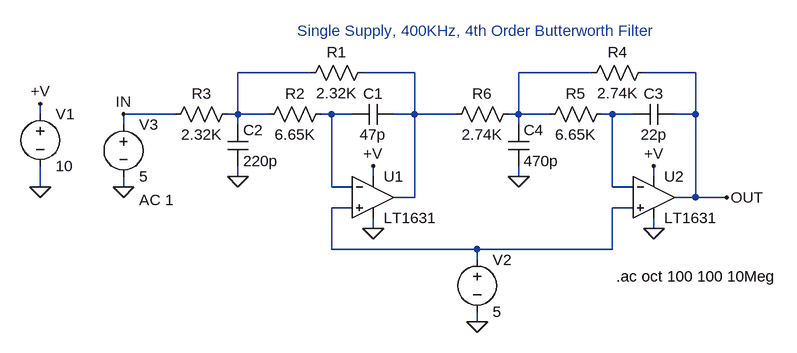
[diagram p0: schematic 1631.asc]
1631.asc, the LTspice schematic file:
Version 4
SHEET 1 1020 680
WIRE 256 96 144 96
WIRE 416 96 336 96
WIRE 688 96 576 96
WIRE 848 96 768 96
WIRE -160 160 -160 144
WIRE 48 160 -32 160
WIRE 144 160 144 96
WIRE 144 160 128 160
WIRE 192 160 144 160
WIRE 288 160 272 160
WIRE 320 160 288 160
WIRE 416 160 416 96
WIRE 416 160 384 160
WIRE 480 160 416 160
WIRE 576 160 576 96
WIRE 576 160 560 160
WIRE 624 160 576 160
WIRE 720 160 704 160
WIRE 752 160 720 160
WIRE 848 160 848 96
WIRE 848 160 816 160
WIRE -32 176 -32 160
WIRE 144 176 144 160
WIRE 576 176 576 160
WIRE 144 256 144 240
WIRE 352 256 352 240
WIRE 576 256 576 240
WIRE 784 256 784 240
WIRE -160 272 -160 240
WIRE -32 272 -32 256
WIRE 288 272 288 160
WIRE 320 272 288 272
WIRE 720 272 720 160
WIRE 752 272 720 272
WIRE 416 288 416 160
WIRE 416 288 384 288
WIRE 848 288 848 160
WIRE 848 288 816 288
WIRE 896 288 848 288
WIRE 320 304 288 304
WIRE 752 304 720 304
WIRE 352 336 352 320
WIRE 784 336 784 320
WIRE 288 368 288 304
WIRE 512 368 288 368
WIRE 720 368 720 304
WIRE 720 368 512 368
WIRE 512 384 512 368
WIRE 512 480 512 464
FLAG -160 272 0
FLAG 352 240 +V
FLAG -160 144 +V
FLAG 352 336 0
FLAG 144 256 0
FLAG 784 240 +V
FLAG 784 336 0
FLAG 576 256 0
FLAG 512 480 0
FLAG -32 272 0
FLAG 896 288 OUT
FLAG -32 160 IN
SYMBOL voltage -160 144 R0
SYMATTR InstName V1
SYMATTR Value 10
SYMBOL cap 384 144 R90
WINDOW 0 0 32 VBottom 0
WINDOW 3 32 32 VTop 0
SYMATTR InstName C1
SYMATTR Value 47p
SYMBOL res 352 80 R90
WINDOW 0 0 56 VBottom 0
WINDOW 3 32 56 VTop 0
SYMATTR InstName R1
SYMATTR Value 2.32K
SYMBOL res 288 144 R90
WINDOW 0 0 56 VBottom 0
WINDOW 3 32 56 VTop 0
SYMATTR InstName R2
SYMATTR Value 6.65K
SYMBOL res 144 144 R90
WINDOW 0 0 56 VBottom 0
WINDOW 3 32 56 VTop 0
SYMATTR InstName R3
SYMATTR Value 2.32K
SYMBOL cap 128 176 R0
SYMATTR InstName C2
SYMATTR Value 220p
SYMBOL cap 816 144 R90
WINDOW 0 0 32 VBottom 0
WINDOW 3 32 32 VTop 0
SYMATTR InstName C3
SYMATTR Value 22p
SYMBOL res 784 80 R90
WINDOW 0 0 56 VBottom 0
WINDOW 3 32 56 VTop 0
SYMATTR InstName R4
SYMATTR Value 2.74K
SYMBOL res 720 144 R90
WINDOW 0 0 56 VBottom 0
WINDOW 3 32 56 VTop 0
SYMATTR InstName R5
SYMATTR Value 6.65K
SYMBOL res 576 144 R90
WINDOW 0 0 56 VBottom 0
WINDOW 3 32 56 VTop 0
SYMATTR InstName R6
SYMATTR Value 2.74K
SYMBOL cap 560 176 R0
SYMATTR InstName C4
SYMATTR Value 470p
SYMBOL voltage 512 368 R0
SYMATTR InstName V2
SYMATTR Value 5
SYMBOL voltage -32 160 R0
WINDOW 123 24 132 Left 0
WINDOW 39 0 0 Left 0
SYMATTR Value2 AC 1
SYMATTR InstName V3
SYMATTR Value 5
SYMBOL opamps\\LT1631 352 224 R0
SYMATTR InstName U1
SYMBOL opamps\\LT1631 784 224 R0
SYMATTR InstName U2
TEXT 726 410 Left 0 !.ac oct 100 100 10Meg
TEXT 512 16 Top 0 ;Single Supply, 400KHz, 4th Order Butterworth Filter

The netlist it stands for:
* 1631.asc
V1 +V 0 10
C1 N002 N004 47p
R1 N002 N001 2.32K
R2 N004 N001 6.65K
R3 N001 IN 2.32K
C2 N001 0 220p
C3 OUT N005 22p
R4 OUT N003 2.74K
R5 N005 N003 6.65K
R6 N003 N002 2.74K
C4 N003 0 470p
V2 N006 0 5
V3 IN 0 5 AC 1
XU1 N006 N004 +V 0 N002 LT1630  ; LT1631, pins In+ In- V+ V- OUT
XU2 N006 N005 +V 0 OUT LT1630  ; LT1631, pins In+ In- V+ V- OUT
.ac oct 100 100 10Meg
* Single Supply, 400KHz, 4th Order Butterworth Filter
.lib LTC.lib
.backanno
.end